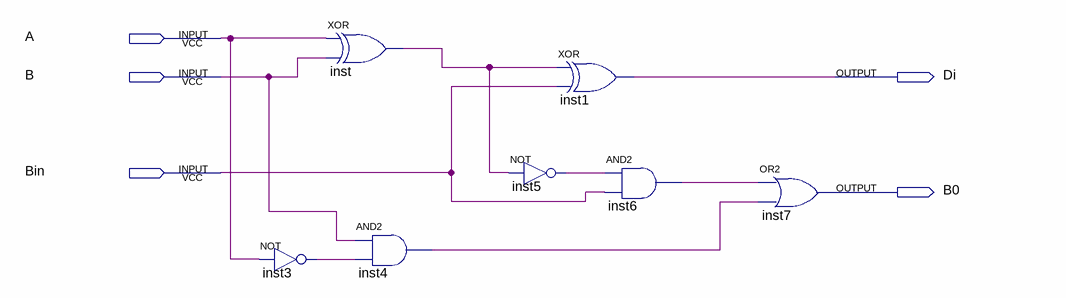
[diagram p0: schematic sheet]
// Quartus schematic Block3.bdf as structural Verilog: 7 symbols, 5 pins
module Block3 (
  input  A,
  input  B,
  input  Bin,
  output Di,
  output B0
);

  wire inst3_out, inst4_out, inst5_out, inst6_out, inst_out;

  not inst3 (inst3_out, A);
  xor inst (inst_out, A, B);
  and inst4 (inst4_out, B, inst3_out);
  not inst5 (inst5_out, inst_out);
  xor inst1 (Di, inst_out, Bin);
  and inst6 (inst6_out, inst5_out, Bin);
  or inst7 (B0, inst6_out, inst4_out);
endmodule
